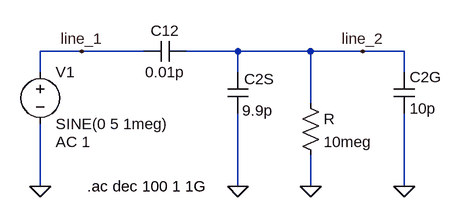
[diagram p0: schematic LM741_4_b.asc]
LM741_4_b.asc, the LTspice schematic file:
Version 4
SHEET 1 880 680
WIRE 48 80 -16 80
WIRE 144 80 48 80
WIRE 288 80 208 80
WIRE 400 80 288 80
WIRE 480 80 400 80
WIRE 544 80 480 80
WIRE -16 112 -16 80
WIRE 288 112 288 80
WIRE 544 112 544 80
WIRE 400 160 400 80
WIRE -16 288 -16 192
WIRE 288 288 288 176
WIRE 400 288 400 240
WIRE 544 288 544 176
FLAG -16 288 0
FLAG 288 288 0
FLAG 400 288 0
FLAG 544 288 0
FLAG 48 80 line_1
FLAG 480 80 line_2
SYMBOL voltage -16 96 R0
WINDOW 123 24 124 Left 2
WINDOW 39 0 0 Left 2
SYMATTR Value2 AC 1
SYMATTR InstName V1
SYMATTR Value SINE(0 5 1meg)
SYMBOL cap 272 112 R0
WINDOW 0 26 11 Left 2
WINDOW 3 23 59 Left 2
SYMATTR InstName C2S
SYMATTR Value 9.9p
SYMBOL cap 208 64 R90
WINDOW 0 0 32 VBottom 2
WINDOW 3 32 32 VTop 2
SYMATTR InstName C12
SYMATTR Value 0.01p
SYMBOL res 384 144 R0
SYMATTR InstName R
SYMATTR Value 10meg
SYMBOL cap 528 112 R0
SYMATTR InstName C2G
SYMATTR Value 10p
TEXT 56 288 Left 2 !.ac dec 100 1 1G

The netlist it stands for:
* LM741_4_b.asc
V1 line_1 0 SINE(0 5 1meg) AC 1
C2S line_2 0 9.9p
C12 line_2 line_1 0.01p
R line_2 0 10meg
C2G line_2 0 10p
.ac dec 100 1 1G
.backanno
.end

* Results of the author's LTspice run, read from the files saved beside the schematic
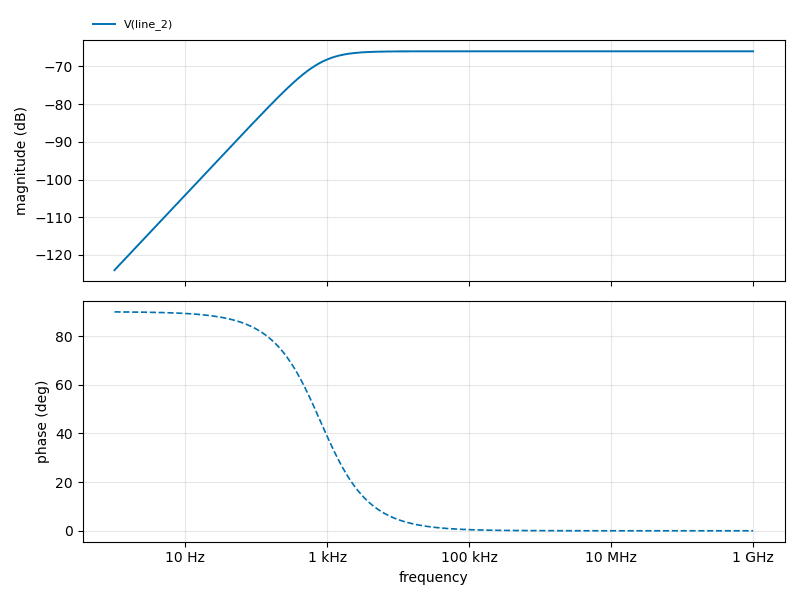
[diagram p1: AC Analysis of LM741_4_b.asc, plotted from the saved traces]
* AC Analysis, 1 run:
*   V(line_2): -124.04 dB at 1 Hz, -65.98 dB at 1 GHz, peak -65.98 dB at 1 GHz, 3 dB below the peak at 799.4 Hz